# Altium schematic sheet SMD final schematic.SchDoc
size A; SheetNumber: 1; SheetTotal: 1
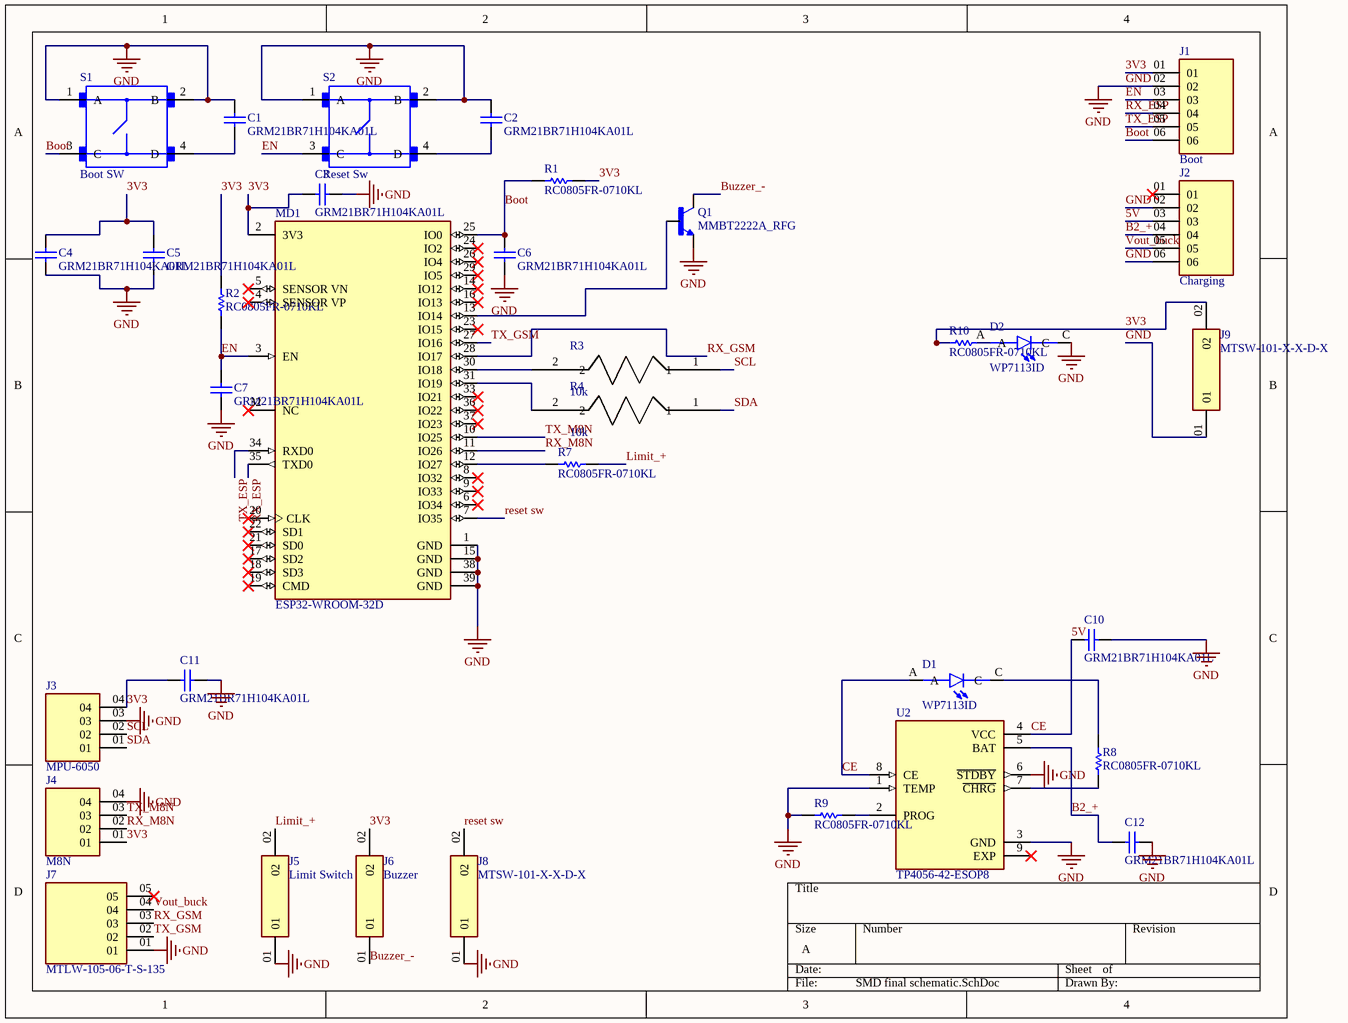
[diagram p0: SMD final schematic.SchDoc]

## Parts
C1  GRM21BR71H104KA01L  [CAPC2013X135X45LL10T25]
C2  GRM21BR71H104KA01L  [CAPC2013X135X45LL10T25]
C3  GRM21BR71H104KA01L  [CAPC2013X135X45LL10T25]
C4  GRM21BR71H104KA01L  [CAPC2013X135X45LL10T25]
C5  GRM21BR71H104KA01L  [CAPC2013X135X45LL10T25]
C6  GRM21BR71H104KA01L  [CAPC2013X135X45LL10T25]
C7  GRM21BR71H104KA01L  [CAPC2013X135X45LL10T25]
C10  GRM21BR71H104KA01L  [CAPC2013X135X45LL10T25]
C11  GRM21BR71H104KA01L  [CAPC2013X135X45LL10T25]
C12  GRM21BR71H104KA01L  [CAPC2013X135X45LL10T25]
D1  WP7113ID  [LED_WP7113ID]
D2  WP7113ID  [LED_WP7113ID]
J1  Boot  [SAMTEC_HMTSW-106-X-X-S-X]
J2  Charging  [SAMTEC_HMTSW-106-X-X-S-X]
J3  MPU-6050  [SAMTEC_MTLW-104-X-X-S-X]
J4  M8N  [SAMTEC_MTLW-104-X-X-S-X]
J5  Limit Switch  [SAMTEC_MTSW-101-X-X-D-X]
J6  Buzzer  [SAMTEC_MTSW-101-X-X-D-X]
J7  MTLW-105-06-T-S-135  [SAMTEC_MTLW-105-06-T-S-135]
J8  MTSW-101-X-X-D-X  [SAMTEC_MTSW-101-X-X-D-X]
J9  MTSW-101-X-X-D-X  [SAMTEC_MTSW-101-X-X-D-X]
MD1  ESP32-WROOM-32D  [FP-ESP32-WROOM-32D-MFG]
Q1  MMBT2222A_RFG  [SOT95P237X112-3N]
R1  RC0805FR-0710KL  [RESC2013X60X35NL10T20]
R2  RC0805FR-0710KL  [RESC2013X60X35NL10T20]
R3  10k  [RESAD1100W55L680D260]
R4  10k  [RESAD1100W55L680D260]
R7  RC0805FR-0710KL  [RESC2013X60X35NL10T20]
R8  RC0805FR-0710KL  [RESC2013X60X35NL10T20]
R9  RC0805FR-0710KL  [RESC2013X60X35NL10T20]
R10  RC0805FR-0710KL  [RESC2013X60X35NL10T20]
S1  Boot SW  [SW_TS-1109]
S2  Reset Sw  [SW_TS-1109]
U2  TP4056-42-ESOP8  [SOIC127P600X175-9N]

## Nets
GND: C1.2 C2.2 C3.2 C4.1 C5.1 C6.1 C7.1 C10.2 C11.2 C12.2 D2.C J1.02 J2.02 J2.06 J3.03 J4.04 J5.01 J7.01 J8.01 J9.01 MD1.1(GND) MD1.15(GND) MD1.38(GND) MD1.39(GND) Q1.2(E) R9.1 S1.1(A) S1.2(B) S2.1(A) S2.2(B) U2.1(TEMP) U2.3(GND) U2.6(~{STDBY})
3V3: C3.1 C4.2 C5.2 C11.1 J1.01 J3.04 J4.01 J6.02 J9.02 MD1.2(3V3) R1.2 R2.2 R10.1
5V: C10.1 D1.A J2.03 U2.4(VCC) U2.8(CE)  [also labelled CE]
B2_+: C12.1 J2.04 U2.5(BAT)
Boot: C6.2 J1.06 MD1.25(IO0) R1.1 S1.3(C)
Buzzer_-: J6.01 Q1.3(C)
EN: C7.2 J1.03 MD1.3(EN) R2.1 S2.3(C)
Limit_+: J5.02 R7.2
reset sw: J8.02 MD1.7(IO35)
RX_ESP: J1.04 MD1.35(TXD0)
RX_GSM: J7.03 MD1.28(IO17)
RX_M8N: J4.02 MD1.11(IO26)
SCL: J3.02 R3.1
SDA: J3.01 R4.1
TX_ESP: J1.05 MD1.34(RXD0)
TX_GSM: J7.02 MD1.27(IO16)
TX_M8N: J4.03 MD1.10(IO25)
Vout_buck: J2.05 J7.04
NetC1_1: C1.1 S1.4(D)
NetC2_1: C2.1 S2.4(D)
NetD1_C: D1.C R8.2
NetD2_A: D2.A R10.2
NetMD1_12: MD1.12(IO27) R7.1
NetMD1_13: MD1.13(IO14) Q1.1(B)
NetMD1_30: MD1.30(IO18) R3.2
NetMD1_31: MD1.31(IO19) R4.2
NetR8_1: R8.1 U2.7(~{CHRG})
NetR9_2: R9.2 U2.2(PROG)

Not connected (* = marked no-connect by the designer): J2 01*; J7 05*; MD1 4(SENSOR_VP)* 5(SENSOR_VN)* 6(IO34)* 8(IO32)* 9(IO33)* 14(IO12)* 16(IO13)* 17(SD2)* 18(SD3)* 19(CMD)* 20(CLK)* 21(SD0)* 22(SD1)* 23(IO15)* 24(IO2)* 26(IO4)* 29(IO5)* 32(NC)* 33(IO21)* 36(IO22)* 37(IO23)*; U2 9(EXP)*

## Library data of the parts
C1-C7 C10-C12 = CMP-2100-03644-1: Chip Capacitor, 0.1 uF, +/- 10%, 50 V, -55 to 125 degC, 0805 (2012 Metric), RoHS, Tape and Reel; Manufacturer: Murata; Voltage: 50V; Capacitance: 100nF; Insulation Resistance: 10GR; Dielectric Material: Ceramic; Dielectric: X7R; Package Description: 2-Pin Surface Mount Device, Body 2 x 1.25 mm; Manufacturer URL: http://www.murata.com/; Case Code (Imperial): 0805; Datasheet URL: http://psearch.en.murata.com/capacitor/product/GRM21BR71H104KA01%23.pdf; Termination: SMD/SMT; Lead Free: LeadFree; Package Quantity: 1; Mount: SurfaceMount; REACH SVHC: Unknown; Thickness: 0.053inch; Height: 1.25mm; Case/Package: 0805; Voltage Rating: 50V; Width: 0.049inch; Case Code (Metric): 2012; Material: Ceramic; Min Operating Temperature: -55degC; RoHSCompliant: true; Datasheet Version: 42675.0; Voltage Rating (DC): 50V; Tolerance: 10%; Package Reference: 0805; Depth: 1.25mm; Length: 2mm; Max Operating Temperature: 125degC; Packaging: TapeandReel; Number of Pins: 2; Radiation Hardening: No
D1 D2 = WP7113ID: Red 617nm LED Indication - Discrete 2V Radial; MF: Kingbright; Price: None; MP: WP7113ID; Package: Radial Kingbright; Check_prices: https://www.snapeda.com/parts/WP7113ID/Kingbright/view-part/?ref=eda; Purchase-URL: https://pricing.snapeda.com/search/part/WP7113ID/?ref=eda; Availability: In Stock; Value: *; SnapEDA_Link: https://www.snapeda.com/parts/WP7113ID/Kingbright/view-part/?ref=snap
J1 J2 = connector: .100 High-Temp Variable Post Height Terminal Strip; MF: SAMTEC; MP: HMTSW-106-07-T-S-200; SnapEDA_Link: https://www.snapeda.com/parts/HMTSW-106-07-T-S-200/Samtec/view-part/?ref=snap; Package: None; Value: *; Check_prices: https://www.snapeda.com/parts/HMTSW-106-07-T-S-200/Samtec/view-part/?ref=eda
J3 J4 = MTLW-104-X-X-S-X: MF: {'manufacturer': u'Samtec Inc.'}; Package: None; Price: None; Value: *; MP: MTLW-104-X-X-S-X; Availability: Unavailable
J5 J6 J8 J9 = MTSW-101-X-X-D-X: Variable Height PCB Header Strips, 0.100 pitch; MF: SAMTEC; MP: MTSW-101-09-L-D-210; SnapEDA_Link: https://www.snapeda.com/parts/MTSW-101-09-L-D-210/Samtec/view-part/?ref=snap; Package: None; Value: *; Check_prices: https://www.snapeda.com/parts/MTSW-101-09-L-D-210/Samtec/view-part/?ref=eda
MD1 = esp32wroom32d: WIFI MODULE 32MBITS SPI FLASH; Manufacturer: Espressif Systems; Max Supply Voltage: 3.6V; Nominal Supply Current: 500mA; Max Frequency: 2484MHz; Number Of Adc Channels: 16; Number Of Gpio: 32; Interface: I2C,SPI,UART,Ethernet,I2S,Other; Data Rate: 150Mbits/s; Min Supply Voltage: 3V; Bandwidth: 72MHz; Sensitivity: -98dBm; Octopart: https://octopart.com/esp32-wroom-32d-espressif+systems-91040050; Package: ESP32-WROOM-32D; ComponentLink2URL: https://www.espressif.com/sites/default/files/documentation/esp32-wroom-32d_esp32-wroom-32u_datasheet_en.pdf; Lead Free: Yes; Category: UNK; Mouser Description: Wi-Fi/BT BLE Module ESP32-D0WD, SPI Flash, UART, P; Device Class L1: Integrated Circuits (ICs); RoHS: TRUE; Temperature Range Low: -40°C; ComponentLink2Description: Datasheet; Digikey Description: WIFI MODULE 32MBITS SPI FLASH; Height: 3.2mm; Temperature: -40°C to +85°C; Manufacturer Part Number: ESP32-WROOM-32D; Device Class L3: Transceivers; Device Class L2: RF Semiconductors and Devices; Temperature Range High: +85°C; Automotive: No
Q1 = MMBT2222A_RFG: SOT-23, 75V, 0.6A, NPN Transistor; MF: Taiwan Semiconductor; MP: MMBT2222A RFG; SnapEDA_Link: https://www.snapeda.com/parts/MMBT2222A%20RFG/Taiwan+Semiconductor/view-part/?ref=snap; Package: SOT-23 Taiwan Semiconductor; Value: *; Check_prices: https://www.snapeda.com/parts/MMBT2222A%20RFG/Taiwan+Semiconductor/view-part/?ref=eda
R1 R2 R7-R10 = CMP-1659-00013-4: Chip Resistor, 10 KOhm, +/- 1%, 0.125 W, -55 to 155 degC, 0805 (2012 Metric), RoHS, Tape and Reel; Manufacturer: Yageo; Voltage Rating: 150 V; Mount: Surface Mount; ComponentLink1Description: Manufacturer URL; ComponentLink2URL: http://www.yageo.com/documents/recent/PYu-RC_Group_51_RoHS_L_04.pdf; Pins: 2; Length: 2 mm; Min Operating Temperature: -55 degC; Height: 0.5 mm; Mounting Technology: Surface Mount; RoHSCompliant: true; REACH SVHC: No SVHC; ComponentLink1URL: http://www.yageo.com/; Max Operating Temperature: 155 degC; PackageReference: 0805; DatasheetVersion: Rev. 4, 02/2016; Package Quantity: 5000; Packaging: Tape and Reel; ComponentLink2Description: Datasheet; PackageDescription: 2-Pin Surface Mounted Device, Body 2 x 1.25 mm
R3 R4 = 10k: Fixed Resistor, Carbon Film, 0.25W, 10000ohm, 250V, 5% +/-Tol, -500,350ppm/Cel, Through Hole Mount; Manufacturer: Yageo; Manufacturer Part Number: CFR-25JR-52-10K; Power: 250mW; Rated Temperature: 70°C; Value: 10kR; Temperature Coefficient (ppm/Cel): 500; Lead Diameter: 0.55mm; Package Length: 6.3mm; Supplier: Future Electronics; Supplier Part Number: 3706249; RoHS: Yes; Category: Through-Hole Resistors; Stock: 15000; Pricing: 5000=0.0065, 15000=0.0063, 20000=0.0063, 50000=0.0061, 75000=0.006 (USD); Mounting Technology: Through Hole; Pins: 2; Package Shape: Tubular; Terminal Finish: Tin; Min Operating Temperature: -55°C; Max Operating Temperature: 155°C; Tolerance: 5%; JESD-609 Code: e3; Resistor Type: FIXED RESISTOR; Construction: Cylindrical; Package Style: AXIAL; Packaging: Tape and Reel; Technology: CARBON FILM; Termination: Wire; Working Voltage: 250V; Reach SVHC Compliant: Yes; RoHS Compliant: Yes; ComponentLink1URL: https://datasheet.ciiva.com:443/pdfs/VipMasterIC/IC/YAGO/YAGO-S-A0009358724/YAGO-S-A0009358724-1.pdf?src-supplier=IHS+Markit; ComponentLink1Description: https://datasheet.ciiva.com:443/pdfs/VipMasterIC/IC/YAGO/YAGO-S-A0009358724/YAGO-S-A0009358724-1.pdf?src-supplier=IHS+Markit; ComponentLink2URL: http://www.mouser.com/ds/2/447/Yageo%20LR_CFR_2013-595289.pdf?src-supplier=Mouser; ComponentLink2Description: http://www.mouser.com/ds/2/447/Yageo%20LR_CFR_2013-595289.pdf?src-supplier=Mouser; ComponentLink3URL: http://www.yageo.com/documents/recent/Yageo%20LR_CFR_2013.pdf?src-supplier=Digikey; ComponentLink3Description: http://www.yageo.com/documents/recent/Yageo%20LR_CFR_2013.pdf?src-supplier=Digikey; ComponentLink4URL: http://www.yageo.com/documents/recent/Yageo%20LR_CFR_2013.pdf?src-supplier=Avnet; ComponentLink4Description: http://www.yageo.com/documents/recent/Yageo%20LR_CFR_2013.pdf?src-supplier=Avnet; ComponentLink5URL: https://datasheet.octopart.com/CFR-25JR-52-10K-Yageo-datasheet-155367611.pdf?src-supplier=Newark; ComponentLink5Description: https://datasheet.octopart.com/CFR-25JR-52-10K-Yageo-datasheet-155367611.pdf?src-supplier=Newark; ComponentLink6URL: http://www.yageo.com/documents/recent/General%20Type_CFR.pdf?src-supplier=Future+Electronics; ComponentLink6Description: http://www.yageo.com/documents/recent/General%20Type_CFR.pdf?src-supplier=Future+Electronics; ComponentLink7URL: https://datasheet.octopart.com/CFR-25JR-52-10K-Yageo-datasheet-137875058.pdf?src-supplier=Future+Electronics; ComponentLink7Description: https://datasheet.octopart.com/CFR-25JR-52-10K-Yageo-datasheet-137875058.pdf?src-supplier=Future+Electronics
S1 S2 = Sw: Heat Sink Full Brick DC/DC Converter Aluminum Top Mount; MP: TS-1109; MF: Samtec Inc.; Price: None; Availability: Unavailable; SnapEDA_Link: https://www.snapeda.com/parts/TS-1109/Samtec%20Inc./view-part/106451/?ref=snap; Value: *; Package: None
U2 = TP4056-42-ESOP8: TP4056-42-ESOP8 TP; MF: Lite-On Semiconductor; SnapEDA_Link: https://www.snapeda.com/parts/TP4056-42-ESOP8/Lite-On/view-part/?ref=snap; Package: None; Value: *; MP: TP4056-42-ESOP8; Check_prices: https://www.snapeda.com/parts/TP4056-42-ESOP8/Lite-On/view-part/?ref=eda
J7 = MTLW-105-06-T-S-135: Package: None; Price: None; Availability: Unavailable; MP: MTLW-105-06-T-S-135; Value: *